# EasyEDA Pro project ProPrj_X-Link OB-RA4M2_M_2024-12-25.epro

# Schematic X-Link OB-RA4M2_M
Board Name: Board1; Create Date: 2024-11-27; Page Name: P1; Project Name: X-Link OB-RA4M2_M; Schematic Name: X-Link OB-RA4M2_M; Update Date: 2024-12-16; Company: 嘉立创EDA; Page Size: A4; Version: V1.0
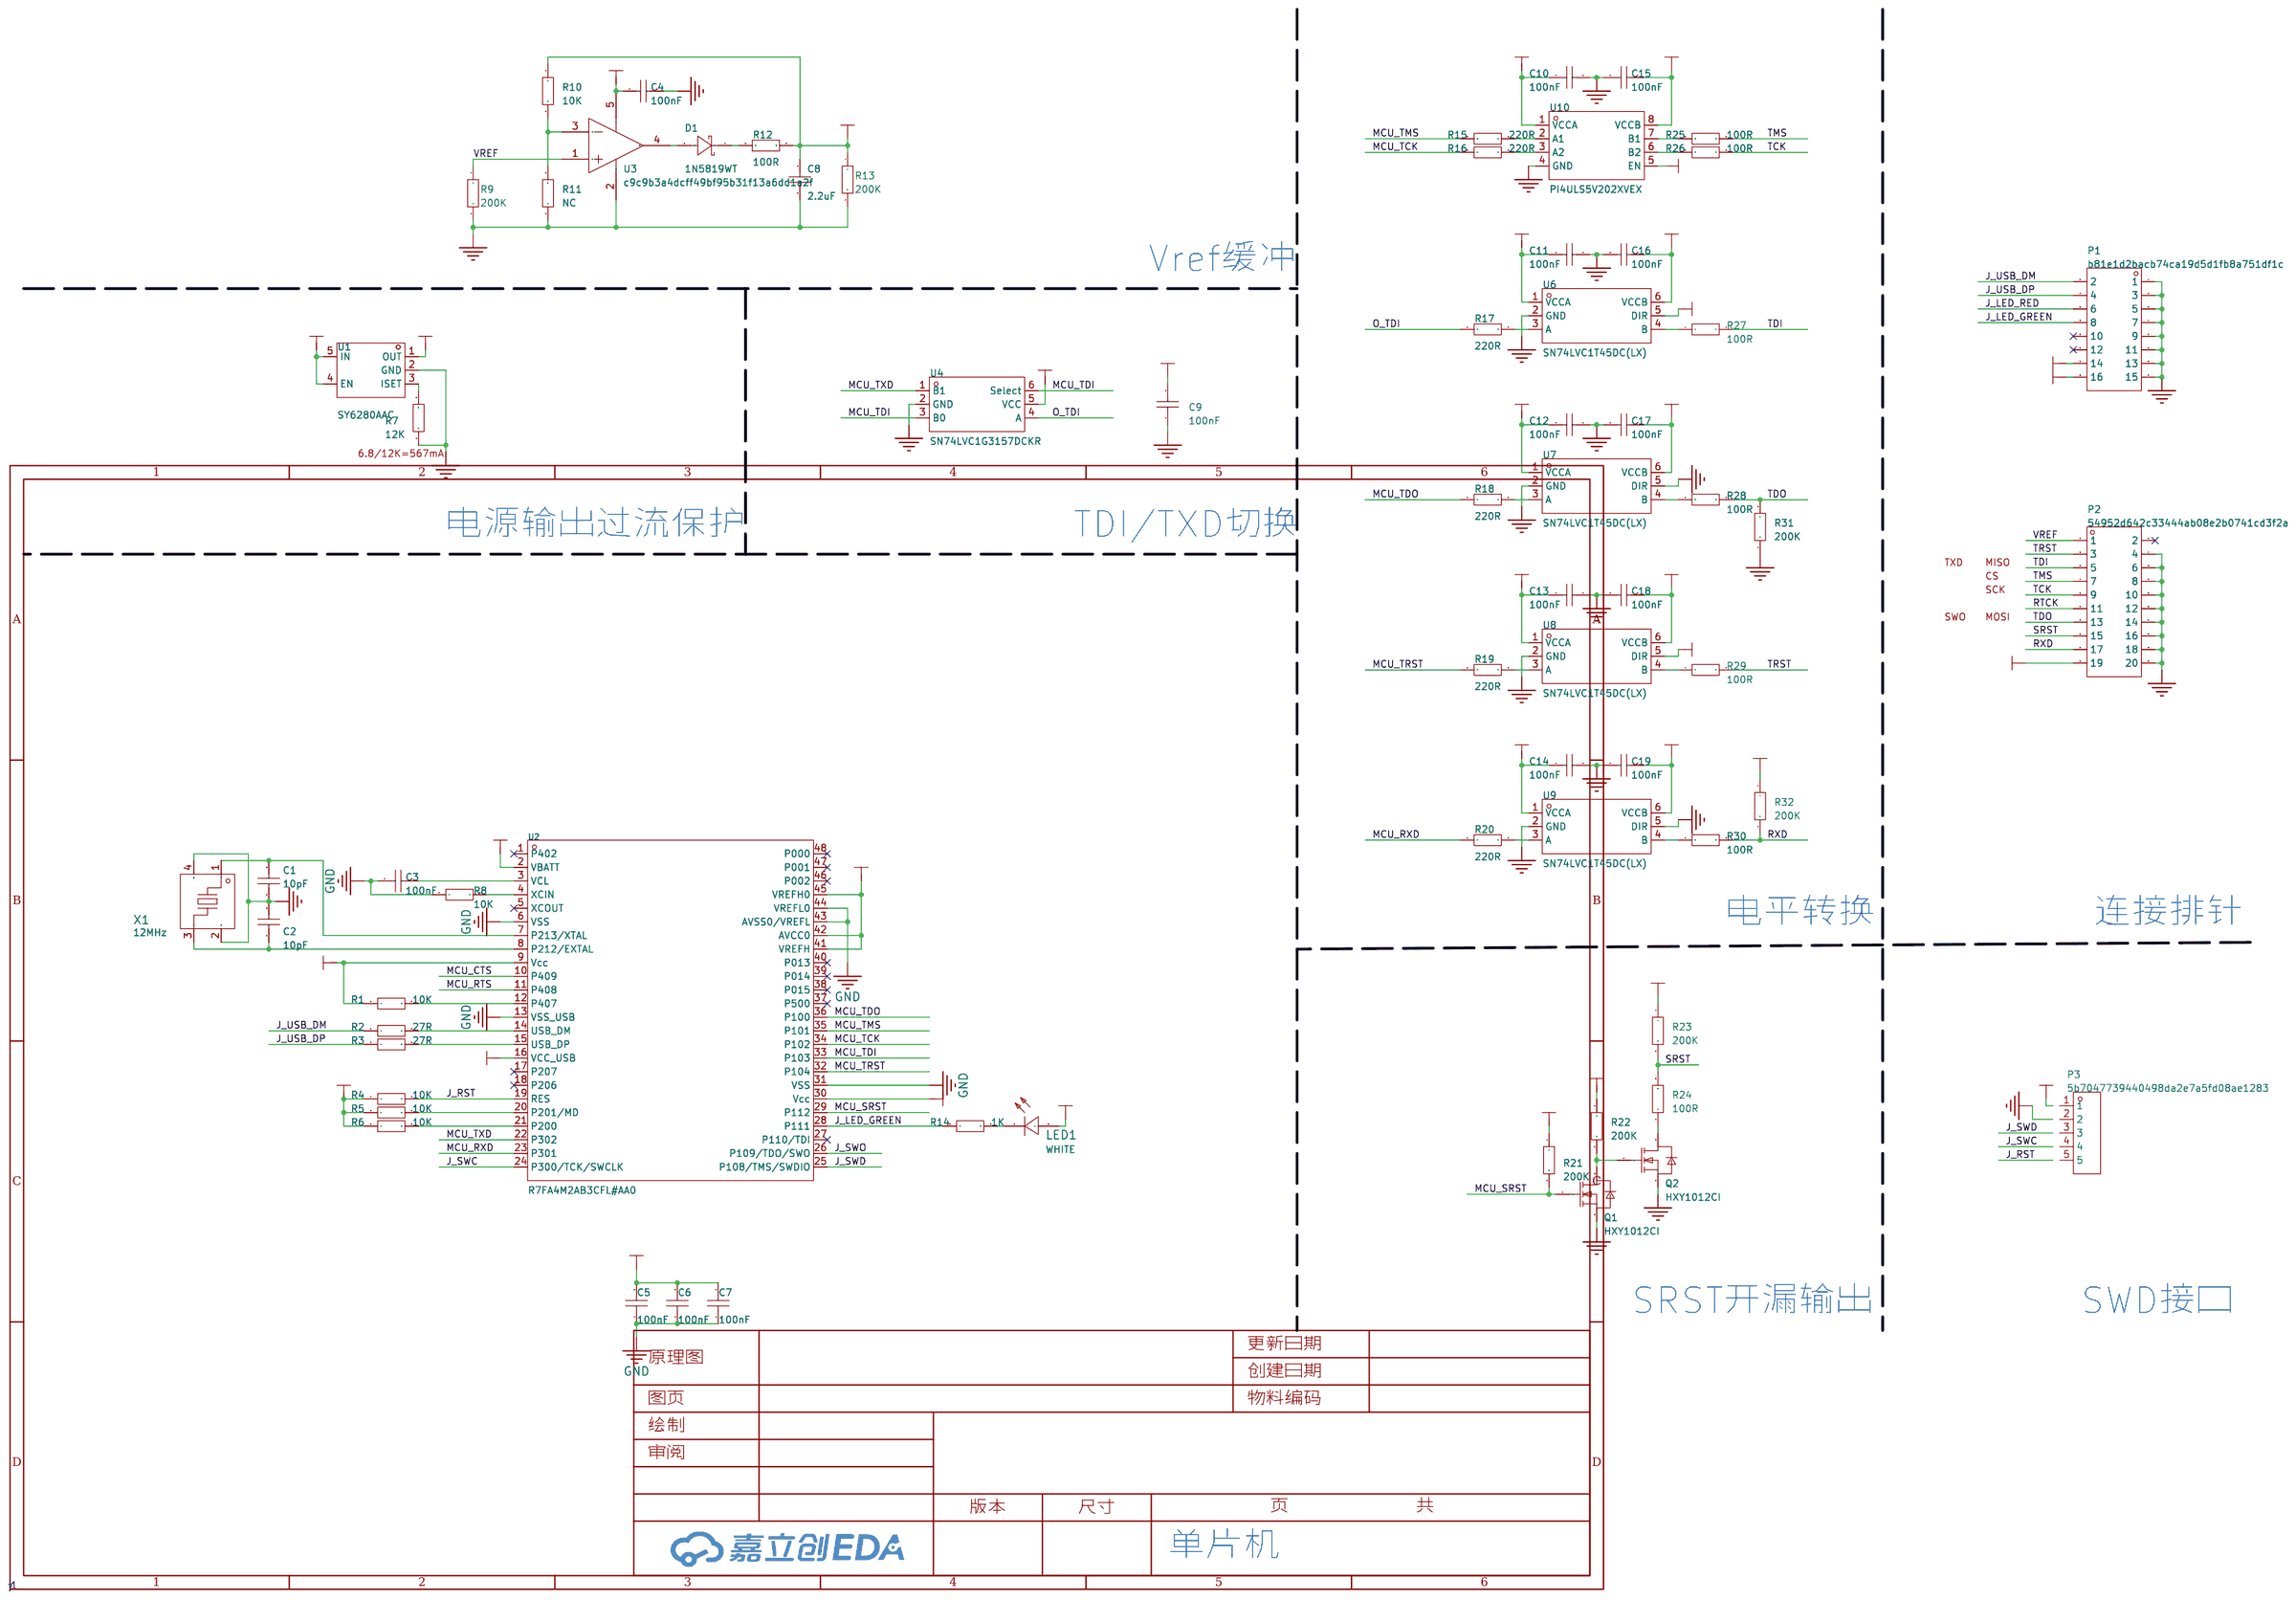
[diagram p0: schematic sheet]

## Parts
C1  10pF  [C0402]
C2  10pF  [C0402]
C3  100nF  [C0402]
C4  100nF  [C0402]
C5  100nF  [C0402]
C6  100nF  [C0402]
C7  100nF  [C0402]
C8  2.2uF  [C0402]
C9  100nF  [C0402]
C10  100nF  [C0402]
C11  100nF  [C0402]
C12  100nF  [C0402]
C13  100nF  [C0402]
C14  100nF  [C0402]
C15  100nF  [C0402]
C16  100nF  [C0402]
C17  100nF  [C0402]
C18  100nF  [C0402]
C19  100nF  [C0402]
D1  1N5819WT  [SOD-523_L1.2-W0.8-LS1.6-RD]
LED1  WHITE  [LED0603]
P1  b81e1d2bacb74ca19d5d1fb8a751df1c  [HDR-TH_16P-P1.27-V-M-R2-C8-S1.27-1]
P2  54952d642c33444ab08e2b0741cd3f2a  [HDR-TH_20P-P1.27-V-M-R2-C10-S1.27]
P3  5b7047739440498da2e7a5fd08ae1283  [HDR-TH_5P-P1.27-V-M]
Q1  HXY1012CI  [SOT-523-3_L1.6-W0.8-P0.50-LS1.6-BR]
Q2  HXY1012CI  [SOT-523-3_L1.6-W0.8-P0.50-LS1.6-BR]
R1  10K  [R0402]
R2  27R  [R0402]
R3  27R  [R0402]
R4  10K  [R0402]
R5  10K  [R0402]
R6  10K  [R0402]
R7  12K  [R0402]
R8  10K  [R0402]
R9  200K  [R0402]
R10  10K  [R0402]
R11  NC  [R0402]
R12  100R  [R0805]
R13  200K  [R0402]
R14  1K  [R0402]
R15  220R  [R0402]
R16  220R  [R0402]
R17  220R  [R0402]
R18  220R  [R0402]
R19  220R  [R0402]
R20  220R  [R0402]
R21  200K  [R0402]
R22  200K  [R0402]
R23  200K  [R0402]
R24  100R  [R0402]
R25  100R  [R0402]
R26  100R  [R0402]
R27  100R  [R0402]
R28  100R  [R0402]
R29  100R  [R0402]
R30  100R  [R0402]
R31  200K  [R0402]
R32  200K  [R0402]
U1  SY6280AAC  [SOT-23-5_L3.0-W1.7-P0.95-LS2.8-BL]
U2  R7FA4M2AB3CFL#AA0  [LQFP-48_L7.0-W7.0-P0.50-LS9.0-BL]
U3  c9c9b3a4dcff49bf95b31f13a6dd1a2f  [SOT-23-5_L2.9-W1.6-P0.95-LS2.8-BR]
U4  SN74LVC1G3157DCKR  [SC70-6_L2.1-W1.3-P0.65-LS2.3-BL]
U6  SN74LVC1T45DC(LX)  [SC-70-6_L2.2-W1.3-P0.65-LS2.1-BR]
U7  SN74LVC1T45DC(LX)  [SC-70-6_L2.2-W1.3-P0.65-LS2.1-BR]
U8  SN74LVC1T45DC(LX)  [SC-70-6_L2.2-W1.3-P0.65-LS2.1-BR]
U9  SN74LVC1T45DC(LX)  [SC-70-6_L2.2-W1.3-P0.65-LS2.1-BR]
U10  PI4ULS5V202XVEX  [UDFN-8_L1.6-W1.2-P0.40-BL]
X1  12MHz  [CRYSTAL-SMD_4P-L2.5-W2.0-BL-A]

## Library data of the parts
C1-C19 = C0402
D1 = 1N5819WT_C5185918: 二极管配置:独立式;正向压降(Vf):600mV@200mA;直流反向耐压(Vr):40V;整流电流:350mA;; LCSC Part Name: 电压:40V 电流:350mA; Supplier Part: C5185918; Manufacturer: Slkor(萨科微); Supplier Footprint: SOD-523; JLCPCB Part Class: 扩展库; Datasheet: https://atta.szlcsc.com/upload/public/pdf/source/20221009/97BA7A7C41FA3EE01B3D72EDF2EE8067.pdf; Supplier: LCSC; Diode Configuration: 独立式; Forward Voltage (Vf@If): 600mV@200mA; Reverse Voltage (Vr): 40V; Rectified Current: 350mA; Reverse Leakage Current (Ir): 5uA@30V
LED1 = LED0603
P1 = HDR2x8_1.27: 插针结构:2x8P;间距:1.27mm;行距:1.27mm;圆针/方针:方针;安装类型:直插;排数:双排;总PIN位数:16P;额定电流:1A;额定电压:500V;配合针长度:3.8mm;塑高:1mm;端接针长度:2.4mm;触头材质:黄铜;触头镀层:-;工作温度范围:-40℃~+105℃;焊接温度(最大值):260℃@10S;颜色:黑色;; LCSC Part Name: 2x8P 间距:1.27mm 方针 直插; Supplier Footprint: 插件,P=1.27mm; JLCPCB Part Class: 扩展库; Datasheet: https://atta.szlcsc.com/upload/public/pdf/source/20230314/463801427F572AD42B1A6214765822D0.pdf; Pin Structure: 2x8P; Pitch: 1.27mm; Row Spacing: 1.27mm; Circluar Pins/Square Pins: 方针; Mounting Type: 直插; Number of Rows: 双排; Number of Pins: 16P; Current Rating (Max): 1A; Voltage Rating (Max): 500V; Length of Mating Pin: 3.8mm; Insulation Height: 1mm; Length of End Connection Pin: 2.4mm; Contact Material: 黄铜; Operating Temperature Range: -40℃~+105℃; Soldering Temperature(Max): 260℃@10S; Color: 黑色
P2 = HDR2x10_1.27: 插针结构:2x10P;间距:1.27mm;行距:1.27mm;圆针/方针:方针;安装类型:直插;排数:双排;总PIN位数:20P;额定电流:1A;额定电压:500V;配合针长度:3.8mm;塑高:1mm;端接针长度:2.4mm;触头材质:黄铜;触头镀层:-;工作温度范围:-40℃~+105℃;焊接温度(最大值):260℃@10S;颜色:黑色;; LCSC Part Name: 2x10P 间距:1.27mm 方针 直插; Supplier Footprint: 插件,P=1.27mm; JLCPCB Part Class: 扩展库; Datasheet: https://atta.szlcsc.com/upload/public/pdf/source/20240702/A94E5E2C58EC168531668174128D95E4.pdf; Pin Structure: 2x10P; Pitch: 1.27mm; Row Spacing: 1.27mm; Circluar Pins/Square Pins: 方针; Mounting Type: 直插; Number of Rows: 双排; Number of Pins: 20P; Current Rating (Max): 1A; Voltage Rating (Max): 500V; Length of Mating Pin: 3.8mm; Insulation Height: 1mm; Length of End Connection Pin: 2.4mm; Contact Material: 黄铜; Operating Temperature Range: -40℃~+105℃; Soldering Temperature(Max): 260℃@10S; Color: 黑色
P3 = HDR1x5_1.27: 插针结构:1x5P;间距:1.27mm;行距:-;圆针/方针:方针;安装类型:直插;排数:单排;总PIN位数:5P;额定电流:1A;额定电压:250V;配合针长度:3.8mm;塑高:1mm;端接针长度:2.4mm;触头材质:黄铜;触头镀层:-;工作温度范围:-40℃~+105℃;焊接温度(最大值):260℃@10S;颜色:黑色;; LCSC Part Name: 1x5P 间距:1.27mm 方针 直插; Supplier Footprint: 插件,P=1.27mm; JLCPCB Part Class: 扩展库; Datasheet: https://atta.szlcsc.com/upload/public/pdf/source/20230316/674E7855FAF1BFD827413D68A2D1697C.pdf; Pin Structure: 1x5P; Pitch: 1.27mm; Circluar Pins/Square Pins: 方针; Mounting Type: 直插; Number of Rows: 单排; Number of Pins: 5P; Current Rating (Max): 1A; Voltage Rating (Max): 250V; Length of Mating Pin: 3.8mm; Insulation Height: 1mm; Length of End Connection Pin: 2.4mm; Contact Material: 黄铜; Operating Temperature Range: -40℃~+105℃; Soldering Temperature(Max): 260℃@10S; Color: 黑色
Q1 Q2 = HXY1012CI: 类型:1个N沟道;漏源电压(Vdss):20V;连续漏极电流(Id):800mA;导通电阻(RDS(on)@Vgs,Id):150mΩ@2.5V,0.5A;功率(Pd):150mW;阈值电压(Vgs(th)@Id):500mV@250uA;; LCSC Part Name: 1个N沟道 耐压:20V 电流:800mA; Supplier Part: C5148644; Manufacturer: HXY MOSFET(华轩阳电子); Supplier Footprint: SOT-523; JLCPCB Part Class: 扩展库; Datasheet: https://atta.szlcsc.com/upload/public/pdf/source/20221216/7678D929A4495F210F49E57C2201325F.pdf; Supplier: LCSC; Type: 1个N沟道; Drain Source Voltage (Vdss): 20V; Continuous Drain Current (Id): 800mA; Drain Source On Resistance (RDS(on)@Vgs,Id): 150mΩ@2.5V,0.5A; Power Dissipation (Pd): 150mW; Gate Threshold Voltage (Vgs(th)@Id): 500mV@250uA; Input Capacitance (Ciss@Vds): 50pF@16V; Reverse Transfer Capacitance (Crss@Vds): 4.5pF; Operating Temperature: -55℃~+150℃
R1-R11 R13-R32 = R0402
R12 = R0805: Tolerance: ±1%; Power(Watts): 125mW; Overload Voltage (Max): 150V
U1 = SY6280AAC_C55136: 低能耗配电开关; Supplier Part: C55136; Manufacturer: silergy(矽力杰); Supplier Footprint: SOT-23-5; JLCPCB Part Class: 扩展库; Datasheet: https://atta.szlcsc.com/upload/public/pdf/source/20161108/1478586372822.pdf; Supplier: LCSC
U2 = R7FA4M2AB3CFL#AA0: CPU内核:ARM-M系列;CPU最大主频:100MHz;工作电压范围:2.7V~3.6V;程序存储容量:254KB;GPIO端口数量:30;; Supplier Part: C3230219; Manufacturer: RENESAS(瑞萨)/IDT; Supplier Footprint: LFQFP-48(7x7); JLCPCB Part Class: 扩展库; Supplier: LCSC; CPU Core: ARM-M系列; CPU Maximum Speed: 100MHz; Operating Voltage Range: 2.7V~3.6V; Program Storage Size: 254KB; GPIO Ports Number: 30; ADC (Bit): 12bit; DAC (Bit): 12bit; Universal Serial Bus: 有; Watchdog: 有; Low-Voltage Detect: 有; Direct Memory Access: 有; Internal Oscillator: 有; Operating Temperature Range: -40℃~+105℃
U3 = LMV321: 轨到轨输入输出单运放; Supplier Footprint: SOT-23-5
U4 = SN74LVC1G3157DCKR: 开关电路:单刀双掷(SPDT)-常开/常闭;通道数:1;导通电阻(Ron@VCC):7Ω;; LCSC Part Name: 二选一模拟开关电路; Supplier Part: C2681224; Manufacturer: UMW(友台半导体); Supplier Footprint: SC-70-6; JLCPCB Part Class: 扩展库; Datasheet: https://atta.szlcsc.com/upload/public/pdf/source/20220825/F082194FBEE56472B5A702A7CC0A8AD7.pdf; Supplier: LCSC; Switch Circuit: 单刀双掷(SPDT)-常开/常闭; Number of Channels: 1; Supply Voltage: 1.65V~5.5V; Turn-on time: 5.2ns; On-State Resistance (Max): 7Ω; Turn-off time: 3.5ns
U6-U9 = SN74LVC1T45DC(LX): 数据速率:420Mbps;电压(VCCA):1.2V~5.5V;电压(VCCB):1.2V~5.5V;电路数:1;; Supplier Part: C22469932; Manufacturer: LX(灵星芯微); Supplier Footprint: SOT-363; JLCPCB Part Class: Extended Part; Datasheet: https://atta.szlcsc.com/upload/public/pdf/source/20240621/300AC48FAFCC5DC630ACF81FE330A7E9.pdf; Supplier: LCSC; Channel Type: 双向; Data Rate: 420Mbps; Supply Voltage (VCCA): 1.2V~5.5V; Supply Voltage (VCCB): 1.2V~5.5V; Number of Circuits: 1
U10 = PI4ULS5V202XVEX: 数据速率:20Mbps;电压(VCCA):1.2V~5.5V;电压(VCCB):1.2V~5.5V;电路数:1;每个电路通道数:2;; LCSC Part Name: 20Mbps 2位双向电平转换器; Supplier Part: C2677370; Manufacturer: DIODES(美台); Supplier Footprint: UDFN-8(1.2x1.6); JLCPCB Part Class: 扩展库; Datasheet: https://atta.szlcsc.com/upload/public/pdf/source/20221028/3F11BF7EE1CEB37ECF71FE83083EAFB9.pdf; Supplier: LCSC; Channel Type: 双向; Data Rate: 20Mbps; Supply Voltage (VCCA): 1.2V~5.5V; Supply Voltage (VCCB): 1.2V~5.5V; Number of Circuits: 1; Channels per Circuit: 2; Output Type: 三态；非反相; Operating Temperature: -40℃~+85℃; Features: 自动方向检测
X1 = XTAL2520

## Nets
3.3V: C5.2 C6.2 C7.2 C9.2 C10.1 C11.1 C12.1 C13.1 C14.1 LED1.2(+) P1.14 R1.1 R4.1 R5.1 R6.1 R21.1 R22.1 U2.2(VBATT) U2.9(Vcc) U2.16(VCC_USB) U2.30(Vcc) U2.41(VREFH) U2.42(AVCC0) U2.45(VREFH0) U4.5(VCC) U6.1(VCCA) U6.5(DIR) U7.1(VCCA) U8.1(VCCA) U8.5(DIR) U9.1(VCCA) U10.1(VCCA) U10.5(EN)
5V: C4.1 P1.16 U1.4(EN) U1.5(IN) U3.5(VCC+)
5V_OUT: P2.19 U1.1(OUT)
GND: C1.1 C2.2 C3.1 C4.2 C5.1 C6.1 C7.1 C8.1 C9.1 C10.2 C11.2 C12.2 C13.2 C14.2 C15.1 C16.1 C17.1 C18.1 C19.1 P1.1 P1.3 P1.5 P1.7 P1.9 P1.11 P1.13 P1.15 P2.4 P2.6 P2.8 P2.10 P2.12 P2.14 P2.16 P2.18 P2.20 Q1.2(S) Q2.2(S) R7.1 R8.1 R9.2 R11.1 R13.2 R31.1 U1.2(GND) U2.6(VSS) U2.13(VSS_USB) U2.31(VSS) U2.43(AVSS0/VREFL) U2.44(VREFL0) U3.2(GND) U4.2(GND) U6.2(GND) U7.2(GND) U7.5(DIR) U8.2(GND) U9.2(GND) U9.5(DIR) U10.4(GND) X1.2(GND) X1.4(GND)
J_LED_GREEN: P1.8 R14.1 U2.28(P111)
J_LED_RED: P1.6
J_RST: R4.2 U2.19(RES)
J_SWC: U2.24(P300/TCK/SWCLK)
J_SWD: U2.25(P108/TMS/SWDIO)
J_SWO: U2.26(P109/TDO/SWO)
J_USB_DM: P1.2 R2.1
J_USB_DP: P1.4 R3.1
MCU_CTS: U2.10(P409)
MCU_RTS: U2.11(P408)
MCU_RXD: R20.1 U2.23(P301)
MCU_SRST: Q1.1(G) R21.2 U2.29(P112)
MCU_TCK: R16.1 U2.34(P102)
MCU_TDI: U2.33(P103) U4.3(B0) U4.6(Select)
MCU_TDO: R18.1 U2.36(P100)
MCU_TMS: R15.1 U2.35(P101)
MCU_TRST: R19.1 U2.32(P104)
MCU_TXD: U2.22(P302) U4.1(B1)
O_TDI: R17.1 U4.4(A)
RTCK: P2.11
RXD: P2.17 R30.2 R32.2
SRST: P2.15 R23.2 R24.2
TCK: P2.9 R26.2
TDI: P2.5 R27.2
TDO: P2.13 R28.2 R31.2
TMS: P2.7 R25.2
TRST: P2.3 R29.2
VIO: C8.2 C15.2 C16.2 C17.2 C18.2 C19.2 R10.1 R12.1 R13.1 R23.1 R32.1 U6.6(VCCB) U7.6(VCCB) U8.6(VCCB) U9.6(VCCB) U10.8(VCCB)
VREF: P2.1 R9.1 U3.1(+IN)
$1N3245: C3.2 U2.3(VCL)
$1N3248: R8.2 U2.4(XCIN)
$1N3444: R1.2 U2.12(P407)
$1N3469: R2.2 U2.14(USB_DM)
$1N3474: R3.2 U2.15(USB_DP)
$1N3583: R5.2 U2.20(P201/MD)
$1N3586: R6.2 U2.21(P200)
$1N4934: LED1.1(-) R14.2
$1N14125: C1.2 U2.7(P213/XTAL) X1.1
$1N14126: C2.1 U2.8(P212/EXTAL) X1.3
$1N15634: R25.1 U10.7(B1)
$1N15637: R26.1 U10.6(B2)
$1N15645: R15.2 U10.2(A1)
$1N15648: R16.2 U10.3(A2)
$1N15959: Q2.3(D) R24.1
$1N16531: R10.2 R11.2 U3.3(-IN)
$1N16533: D1.1 R12.2
$1N16535: D1.2 U3.4(OUT)
$1N17836: R27.1 U6.4(B)
$1N17840: R17.2 U6.3(A)
$1N18390: R28.1 U7.4(B)
$1N18396: R18.2 U7.3(A)
$1N18633: R29.1 U8.4(B)
$1N18638: R19.2 U8.3(A)
$1N18909: R30.1 U9.4(B)
$1N18911: R20.2 U9.3(A)
$1N20562: R7.2 U1.3(ISET)
$1N22925: Q1.3(D) Q2.1(G) R22.2

Not connected (* = marked no-connect by the designer): P1 10* 12*; P2 2*; P3 1 2 3 4 5; U2 1(P402)* 5(XCOUT)* 17(P207)* 18(P206)* 27(P110/TDI)* 37(P500)* 38(P015)* 39(P014)* 40(P013)* 46(P002)* 47(P001)* 48(P000)*

## Notes on the sheet
- Vref缓冲
- 6.8/12K=567mA
- 电源输出过流保护
- TDI/TXD切换
- TXD
- MISO
- CS
- SCK
- SWO
- MOSI
- 电平转换
- 连接排针
- SRST开漏输出
- SWD接口
- 单片机

# Board X-Link OB-RA4M2_M
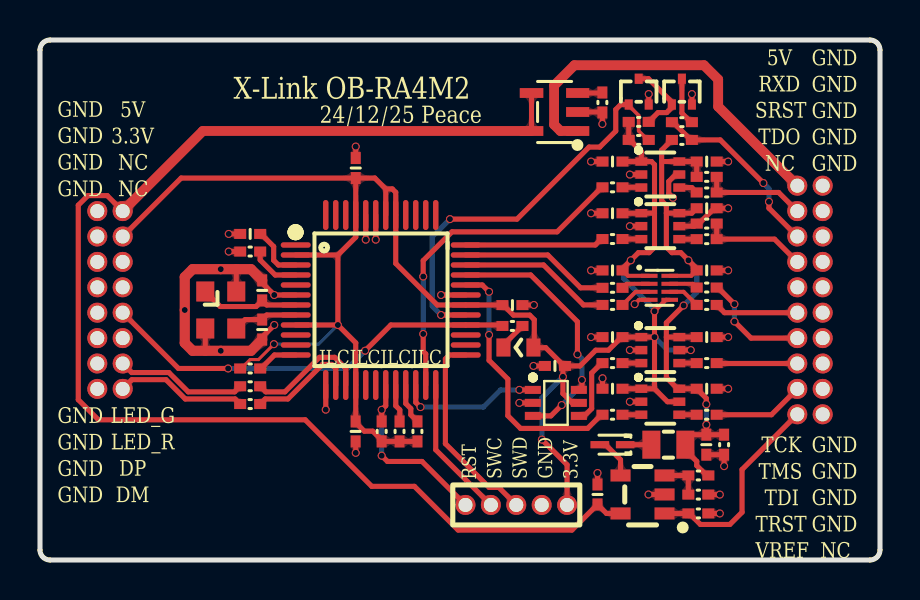
[diagram p1: board, top side]
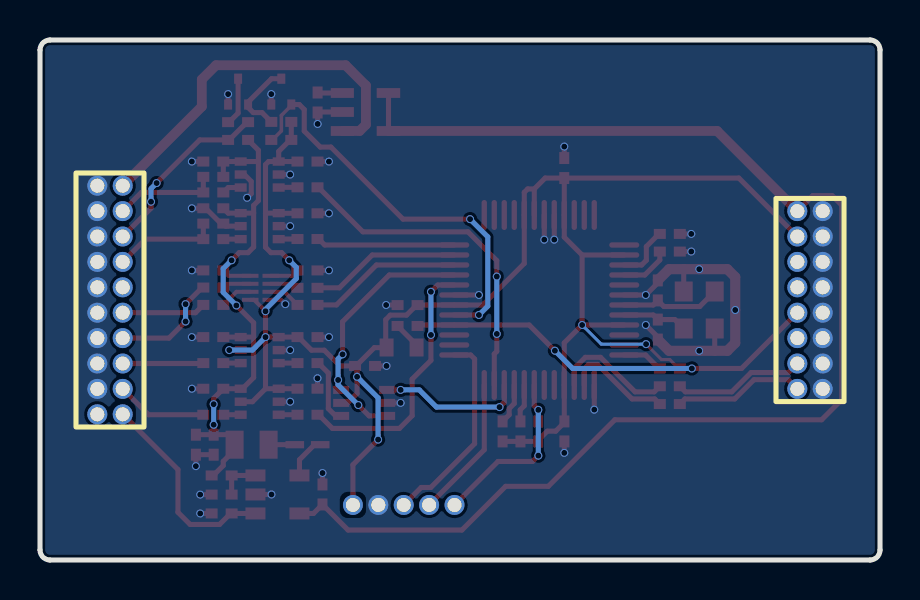
[diagram p2: board, bottom side, seen from below]

Outline 42 x 26 mm; copper layers: Top Layer, Bottom Layer. Coordinates in mm from the lower left corner of the outline.
Outline path: 0,25.5 0,0.5 arc(0.15,0.15) 0.5,0 41.5,0 arc(41.85,0.15) 42,0.5 42,25.5 arc(41.85,25.85) 41.5,26 0.5,26 arc(0.15,25.85) 0,25.5
Stack: Top Layer 0.035mm / Dielectric1 1.51mm FR4 er 4.5 / Bottom Layer 0.035mm

## Design rules (mm)
template: 双面板
spacing copperThickness1oz (default): track to track 0.102, other pairs 0.102 to 0.201
spacing copperThickness2oz: track to track 0.203, other pairs 0.152 to 0.3
track width copperThickness1oz (default): min 0.102, default 0.254, max 2.54
track width copperThickness2oz: min 0.203, default 0.254, max 2.54
differential pair differentialPair (default): width min 0.127, default 0.254, max 2.54; gap min 0.152, default 0.152
via viaSize (default): diameter min 0.399, default 0.399, max 10; hole min 0.3, default 0.3, max 6.299

## Placement (name value [footprint] x y rotation side)
C1  10pF  [C0402]  11.11 13.48 270 top
C2  10pF  [C0402]  11.11 11.52 270 top
C3  100nF  [C0402]  10.51 16.3 0 top
C4  100nF  [C0402]  27.88 3.28 90 top
C5  100nF  [C0402]  15.78 6.43 90 top
C6  100nF  [C0402]  23.62 12.74 180 top
C7  100nF  [C0402]  15.79 19.6 270 top
C8  2.2uF  [C0402]  33.32 5.77 90 top
C9  100nF  [C0402]  25.75 9.7 0 top
C10  100nF  [C0402]  28.63 14.48 180 top
C11  100nF  [C0402]  28.63 11.15 180 top
C12  100nF  [C0402]  28.63 17.34 180 top
C13  100nF  [C0402]  28.63 8.56 180 top
C14  100nF  [C0402]  28.63 19.92 180 top
C15  100nF  [C0402]  33.34 14.48 180 top
C16  100nF  [C0402]  33.34 11.15 180 top
C17  100nF  [C0402]  33.34 17.59 180 top
C18  100nF  [C0402]  33.34 8.56 180 top
C19  100nF  [C0402]  33.34 19.92 180 top
D1  1N5819WT  [SOD-523_L1.2-W0.8-LS1.6-RD]  28.63 5.77 180 top
LED1  WHITE  [LED0603]  23.92 10.62 0 top
P1  b81e1d2bacb74ca19d5d1fb8a751df1c  [HDR-TH_16P-P1.27-V-M-R2-C8-S1.27-1]  3.5 13 90 bottom
P2  54952d642c33444ab08e2b0741cd3f2a  [HDR-TH_20P-P1.27-V-M-R2-C10-S1.27]  38.5 13 90 bottom
P3  5b7047739440498da2e7a5fd08ae1283  [HDR-TH_5P-P1.27-V-M]  23.81 2.75 180 top
Q1  HXY1012CI  [SOT-523-3_L1.6-W0.8-P0.50-LS1.6-BR]  29.94 23.42 270 top
Q2  HXY1012CI  [SOT-523-3_L1.6-W0.8-P0.50-LS1.6-BR]  32.1 23.42 270 top
R1  10K  [R0402]  10.51 9.58 0 top
R2  27R  [R0402]  10.51 7.8 0 top
R3  27R  [R0402]  10.51 8.69 0 top
R4  10K  [R0402]  17.08 6.43 90 top
R5  10K  [R0402]  17.98 6.43 90 top
R6  10K  [R0402]  18.87 6.43 90 top
R7  12K  [R0402]  28.12 22.88 90 top
R8  10K  [R0402]  10.51 15.42 0 top
R9  200K  [R0402]  32.92 2.33 0 top
R10  10K  [R0402]  32.92 4.23 180 top
R11  NC  [R0402]  32.92 3.27 180 top
R12  100R  [R0805]  31.42 5.77 180 top
R13  200K  [R0402]  34.21 5.77 270 top
R14  1K  [R0402]  23.62 11.7 0 top
R15  220R  [R0402]  28.63 13.61 0 top
R16  220R  [R0402]  28.63 12.75 0 top
R17  220R  [R0402]  28.63 9.85 0 top
R18  220R  [R0402]  28.63 16.05 0 top
R19  220R  [R0402]  28.63 7.26 0 top
R20  220R  [R0402]  28.63 18.63 0 top
R21  200K  [R0402]  29.94 21 0 top
R22  200K  [R0402]  29.94 21.91 0 top
R23  200K  [R0402]  32.1 21 0 top
R24  100R  [R0402]  32.1 21.89 180 top
R25  100R  [R0402]  33.34 13.62 0 top
R26  100R  [R0402]  33.34 12.75 0 top
R27  100R  [R0402]  33.34 9.85 0 top
R28  100R  [R0402]  33.34 16.04 0 top
R29  100R  [R0402]  33.34 7.26 0 top
R30  100R  [R0402]  33.34 18.38 0 top
R31  200K  [R0402]  33.34 16.82 0 top
R32  200K  [R0402]  33.34 19.16 0 top
U1  SY6280AAC  [SOT-23-5_L3.0-W1.7-P0.95-LS2.8-BL]  25.73 22.4 90 top
U2  R7FA4M2AB3CFL#AA0  [LQFP-48_L7.0-W7.0-P0.50-LS9.0-BL]  17.04 13 270 top
U3  c9c9b3a4dcff49bf95b31f13a6dd1a2f  [SOT-23-5_L2.9-W1.6-P0.95-LS2.8-BR]  30.13 3.28 0 top
U4  SN74LVC1G3157DCKR  [SC70-6_L2.1-W1.3-P0.65-LS2.3-BL]  25.79 7.86 270 top
U6  SN74LVC1T45DC(LX)  [SC-70-6_L2.2-W1.3-P0.65-LS2.1-BR]  31.02 10.5 180 top
U7  SN74LVC1T45DC(LX)  [SC-70-6_L2.2-W1.3-P0.65-LS2.1-BR]  31.02 16.69 180 top
U8  SN74LVC1T45DC(LX)  [SC-70-6_L2.2-W1.3-P0.65-LS2.1-BR]  31.02 7.91 180 top
U9  SN74LVC1T45DC(LX)  [SC-70-6_L2.2-W1.3-P0.65-LS2.1-BR]  31.02 19.27 180 top
U10  PI4ULS5V202XVEX  [UDFN-8_L1.6-W1.2-P0.40-BL]  30.98 13.61 270 top
X1  12MHz  [CRYSTAL-SMD_4P-L2.5-W2.0-BL-A]  9.04 12.5 270 top

## Footprints (pads in the part's own frame, mm; a bottom-side part is the same pattern mirrored in y, then rotated)
C0402
  rect 0.6x0.5 smd: 1(-0.5,0) 2(0.5,0)
CRYSTAL-SMD_4P-L2.5-W2.0-BL-A
  rect 1x0.9 smd: 1(-0.925,-0.775) 2(0.925,-0.775) 3(0.925,0.775) 4(-0.925,0.775)
HDR-TH_5P-P1.27-V-M
  rrect 1x1 hole 0.7: 1(-2.54,0)
  round 1 hole 0.7: 2(-1.27,0) 3(0,0) 4(1.27,0) 5(2.54,0)
HDR-TH_16P-P1.27-V-M-R2-C8-S1.27-1
  rrect 1x1 hole 0.7: 1(-4.445,-0.635)
  round 1 hole 0.7: 2(-4.445,0.635) 3(-3.175,-0.635) 4(-3.175,0.635) 5(-1.905,-0.635) 6(-1.905,0.635) 7(-0.635,-0.635) 8(-0.635,0.635) 9(0.635,-0.635) 10(0.635,0.635) 11(1.905,-0.635) 12(1.905,0.635) 13(3.175,-0.635) 14(3.175,0.635) 15(4.445,-0.635) 16(4.445,0.635)
HDR-TH_20P-P1.27-V-M-R2-C10-S1.27
  rrect 1x1 hole 0.7: 1(-5.715,-0.635)
  round 1 hole 0.7: 2(-5.715,0.635) 3(-4.445,-0.635) 4(-4.445,0.635) 5(-3.175,-0.635) 6(-3.175,0.635) 7(-1.905,-0.635) 8(-1.905,0.635) 9(-0.635,-0.635) 10(-0.635,0.635) 11(0.635,-0.635) 12(0.635,0.635) 13(1.905,-0.635) 14(1.905,0.635) 15(3.175,-0.635) 16(3.175,0.635) 17(4.445,-0.635) 18(4.445,0.635) 19(5.715,-0.635) 20(5.715,0.635)
LED0603
  rect 0.7x0.9 smd: 1(-0.75,0.008) 2(0.75,0.008)
LQFP-48_L7.0-W7.0-P0.50-LS9.0-BL
  oval 0.27x1.5 smd: 1(-2.75,-4.25) 2(-2.25,-4.25) 3(-1.75,-4.25) 4(-1.25,-4.25) 5(-0.75,-4.25) 6(-0.25,-4.25) 7(0.25,-4.25) 8(0.75,-4.25) 9(1.25,-4.25) 10(1.75,-4.25) 11(2.25,-4.25) 12(2.75,-4.25) 25(2.75,4.25) 26(2.25,4.25) 27(1.75,4.25) 28(1.25,4.25) 29(0.75,4.25) 30(0.25,4.25) 31(-0.25,4.25) 32(-0.75,4.25) 33(-1.25,4.25) 34(-1.75,4.25) 35(-2.25,4.25) 36(-2.75,4.25)
  oval 1.5x0.27 smd: 13(4.25,-2.75) 14(4.25,-2.25) 15(4.25,-1.75) 16(4.25,-1.25) 17(4.25,-0.75) 18(4.25,-0.25) 19(4.25,0.25) 20(4.25,0.75) 21(4.25,1.25) 22(4.25,1.75) 23(4.25,2.25) 24(4.25,2.75) 37(-4.25,2.75) 38(-4.25,2.25) 39(-4.25,1.75) 40(-4.25,1.25) 41(-4.25,0.75) 42(-4.25,0.25) 43(-4.25,-0.25) 44(-4.25,-0.75) 45(-4.25,-1.25) 46(-4.25,-1.75) 47(-4.25,-2.25) 48(-4.25,-2.75)
R0402
  rect 0.6x0.5 smd: 1(-0.5,0) 2(0.5,0)
R0805
  rect 0.9x1.4 smd: 1(-0.85,0) 2(0.85,0)
SC70-6_L2.1-W1.3-P0.65-LS2.3-BL
  rect 0.4x0.8 smd: 1(-0.65,-1.15) 2(-0.001,-1.15) 3(0.65,-1.15) 4(0.65,1.15) 5(0,1.15) 6(-0.65,1.15)
SC-70-6_L2.2-W1.3-P0.65-LS2.1-BR
  rect 0.6x0.42 smd: 1(0.95,-0.65) 2(0.95,0) 3(0.95,0.65) 4(-0.95,0.65) 5(-0.95,0) 6(-0.95,-0.65)
SOD-523_L1.2-W0.8-LS1.6-RD
  rect 0.93x0.36 smd: 1(-0.635,0) 2(0.635,0)
SOT-23-5_L2.9-W1.6-P0.95-LS2.8-BR
  rect 1x0.6 smd: 1(1.1,-0.95) 2(1.1,0) 3(1.1,0.95) 4(-1.1,0.95) 5(-1.1,-0.95)
SOT-23-5_L3.0-W1.7-P0.95-LS2.8-BL
  rect 0.49x1.157 smd: 1(-0.95,-1.153) 2(0,-1.153) 3(0.95,-1.153)
  rect 0.49x1.175 smd: 4(0.95,1.153) 5(-0.95,1.153)
SOT-523-3_L1.6-W0.8-P0.50-LS1.6-BR
  rect 0.51x0.4 smd: 1(0.645,-0.5) 2(0.645,0.5) 3(-0.645,0)
UDFN-8_L1.6-W1.2-P0.40-BL
  rect 0.2x0.825 smd: 1(-0.6,-0.512) 2(-0.2,-0.512) 3(0.2,-0.512) 4(0.6,-0.512) 5(0.6,0.512) 6(0.2,0.512) 7(-0.2,0.512) 8(-0.6,0.512)

## Nets
As in the schematic, except:
3.3V: C5.2 C6.2 C7.2 C9.2 C10.1 C11.1 C12.1 C13.1 C14.1 LED1.2 P1.14 P3.1 R1.1 R4.1 R5.1 R6.1 R21.1 R22.1 U2.2 U2.9 U2.16 U2.30 U2.41 U2.42 U2.45 U4.5 U6.1 U6.5 U7.1 U8.1 U8.5 U9.1 U10.1 U10.5
GND: C1.1 C2.2 C3.1 C4.2 C5.1 C6.1 C7.1 C8.1 C9.1 C10.2 C11.2 C12.2 C13.2 C14.2 C15.1 C16.1 C17.1 C18.1 C19.1 P1.1 P1.3 P1.5 P1.7 P1.9 P1.11 P1.13 P1.15 P2.4 P2.6 P2.8 P2.10 P2.12 P2.14 P2.16 P2.18 P2.20 P3.2 Q1.2 Q2.2 R7.1 R8.1 R9.2 R11.1 R13.2 R31.1 U1.2 U2.6 U2.13 U2.31 U2.43 U2.44 U3.2 U4.2 U6.2 U7.2 U7.5 U8.2 U9.2 U9.5 U10.4 X1.2 X1.4
J_RST: P3.5 R4.2 U2.19
J_SWC: P3.4 U2.24
J_SWD: P3.3 U2.25

Pads without a net: P1 10 12; P2 2; U2 1 5 17 18 27 37 38 39 40 46 47 48

## Via types
v1: diameter 0.4, hole 0.3, Top Layer to Bottom Layer, 71 vias

## Routing (per net, layer and track width the routed paths; a pad name or vN(x,y) marks a point on that pad's centre or on a via; arc(x,y) is an arc through that point)
3.3V: length 100
  Top Layer w0.152: R1.1 10.06,9.58 10.51,10.02 10.93,10.02 v1(11.7,10.79)
  Top Layer w0.201: U10.1 29.4,14.21 C10.1 ; v1(30.73,12.44) 31.3,13.01 U10.5
  Top Layer w0.254: v1(30.73,12.44) v1(30.73,11.15) ; v1(30.73,11.15) U6.1 C11.1 29.08,11.15 28.42,10.49 27.79,10.49 27,9.7 C9.2 ; v1(30.73,11.15) 30.73,8.56 ; U9.1 30.57,19.92 30.73,19.77 30.73,17.34 ; U9.1 30.07,20.43 29.49,21 R21.1 R22.1 ; U9.1 C14.1 ; v1(14.89,11.75) U2.9 ; v1(14.89,11.75) 14.89,15.25 ; v1(14.89,11.75) 15.79,10.86 U2.16 15.79,6.94 C5.2 15.78,6.88 16.22,6.44 16.64,6.44 17.08,5.99 R4.1 R5.1 R6.1 ; v1(32.54,10.5) U6.5 ; C7.2 U2.45 15.79,16.14 14.89,15.25 ; C7.2 7.06,19.1 P1.14 ; C7.2 16.74,19.1 17.29,18.55 ; U4.5 26.61,7.86 26.15,8.32 v1(26.15,9.16) 26.15,9.6 C9.2 ; U8.5 31.38,7.91 30.73,8.56 ; C9.2 26.2,9.7 25.28,10.62 24.67,10.62 24.71,10.66 24.71,12.01 24.49,12.24 23.67,12.24 23.17,12.74 C6.2 23.12,12.75 U2.30 19.86,12.75 17.79,14.83 U2.41 17.79,18.38 17.62,18.55 17.29,18.55 ; 17.29,18.55 U2.42 ; 30.73,17.34 U7.1 30.06,17.34 C12.1 ; 30.73,17.34 30.73,15.64 30.45,15.37 29.92,15.37 v1(29.54,14.99) 29.13,14.57 C10.1 ; 14.89,15.25 U2.2 ; P3.1 26.35,4.76 v1(25.1,6.02) ; 30.73,8.56 U8.1 C13.1
  Bottom Layer w0.152: v1(11.7,10.79) 13.94,10.79 v1(14.89,11.75)
  Bottom Layer w0.254: v1(30.73,12.44) 30.73,12.53 29.18,14.07 29.18,14.63 v1(29.54,14.99) ; v1(32.54,10.5) 31.38,10.5 v1(30.73,11.15) ; v1(25.1,6.02) 25.1,8.11 v1(26.15,9.16)
5V: length 67
  Top Layer w0.254: 24.58,23.35 24.58,21.45 ; P1.16 3.36,18.22 2.39,18.22 1.91,17.74 1.91,8.01 2.92,7.01 13.26,7.01 16.59,3.68 18.72,3.68 20.9,1.5 26.6,1.5 C4.1 28.33,2.33 U3.5
  Top Layer w0.49: P1.16 8.14,21.45 24.58,21.45
5V_OUT: length 19.1
  Top Layer w0.49: P2.19 33.91,22.67 33.91,24.03 33.2,24.74 26.72,24.74 25.7,23.72 25.7,21.77 26.02,21.45 U1.1
GND: length 45.6
  Top Layer w0.201: U10.4 29.95,13.01 v1(29.73,12.79)
  Top Layer w0.254: v1(23.97,7.86) U4.2 ; v1(34.41,14.48) C15.1 ; v1(28.13,9.09) C13.2 ; v1(27.55,14.48) C10.2 ; v1(28.12,21.8) R7.1 28.09,22.4 U1.2 ; v1(16.79,16.02) U2.43 ; v1(34.41,19.92) C19.1 ; v1(16.29,16.02) U2.44 ; v1(33.99,2.33) R9.2 ; v1(29.49,10.5) U6.2 ; v1(29.49,16.69) U7.2 ; v1(15.79,5.36) 15.79,5.93 ; v1(27.55,19.92) C14.2 ; v1(20.05,13.25) U2.31 ; v1(15.79,20.67) C7.1 ; v1(34.21,4.69) R13.2 C8.1 ; v1(34.41,17.59) C17.1 33.72,17.59 32.95,16.82 R31.1 32.71,16.69 U7.5 ; v1(9.44,15.42) R8.1 ; U2.6 v1(11.71,13.25) 11.08,13.88 11.08,13.95 C1.1 ; v1(24.69,12.75) 24.12,12.75 ; v1(24.68,9.7) C9.1 ; v1(32.6,23.3) Q2.2 ; X1.2 8.26,10.46 ; v1(11.71,11.75) 11.08,11.12 11.08,11.05 C2.2 ; v1(31.64,18.11) 31.44,18.32 31.44,18.93 31.78,19.27 U9.5 ; v1(9.44,16.3) C3.1 ; X1.4 9.81,14.54 ; v1(27.55,11.15) C11.2 ; v1(27.55,17.34) C12.2 ; v1(29.49,19.27) U9.2 ; v1(30.44,23.3) Q1.2 ; v1(27.88,4.35) C4.2 ; v1(29.49,7.91) U8.2 ; v1(34.41,8.56) C18.1 ; v1(34.41,11.15) C16.1 ; v1(30.43,3.28) U3.2 ; v1(14.29,7.52) U2.13 ; v1(33.99,3.27) R11.1
  Top Layer w0.508: C1.1 10.55,14.54 v1(9.04,14.54) 7.63,14.54 7.24,14.15 v1(7.24,12.5) 7.24,10.85 7.63,10.46 v1(9.04,10.46) 10.55,10.46 C2.2
J_LED_GREEN: length 21.1
  Top Layer w0.254: R14.1 23.07,11.75 U2.28 17.54,11.75 v1(16.26,10.47) ; P1.8 6.92,9.58 v1(9.41,9.58)
  Bottom Layer w0.254: v1(9.41,9.58) 15.37,9.58 v1(16.26,10.47)
J_RST: length 9.4
  Top Layer w0.254: P3.5 19.1,4.93 17.37,4.93 v1(17.08,5.22) ; U2.19 17.29,7.71 v1(17.08,7.51) R4.2
  Bottom Layer w0.254: v1(17.08,7.51) v1(17.08,5.22)
J_SWC: length 7.1
  Top Layer w0.254: U2.24 19.79,5.51 P3.4
J_SWD: length 10.2
  Top Layer w0.254: U2.25 20.47,10.25 20.27,10.05 20.27,5.82 22.46,3.63 22.94,3.63 P3.3
J_USB_DM: length 6.6
  Top Layer w0.254: P1.2 4.6,9.02 6.3,9.02 7.26,8.05 9.76,8.05 R2.1
J_USB_DP: length 6.6
  Top Layer w0.254: R3.1 9.73,8.41 7.41,8.41 6.45,9.37 4.59,9.37 P1.4
MCU_RXD: length 16.8
  Top Layer w0.254: U2.23 19.29,10.3 19.16,10.43 v1(19.16,11.3) ; v1(19.16,14.17) 19.16,14.97 20.6,16.41 25.86,16.41 28.08,18.63 R20.1
  Bottom Layer w0.254: v1(19.16,14.17) 19.16,11.33 19.19,11.3
MCU_SRST: length 20.7
  Top Layer w0.178: R21.2 30.38,21 29.93,21.46 29.93,22.23 29.44,22.72 Q1.1
  Top Layer w0.254: Q1.1 29.04,22.77 28.79,22.52 28.79,21.45 27.99,20.65 27.45,20.65 23.85,17.04 v1(20.5,17.04) ; v1(20.05,12.25) U2.29
  Bottom Layer w0.254: v1(20.05,12.25) 19.61,12.7 19.61,16.15 v1(20.5,17.04)
MCU_TCK: length 7.7
  Top Layer w0.254: R16.1 27.17,12.75 25.18,14.75 U2.34
MCU_TDI: length 13.5
  Top Layer w0.254: U2.33 24.54,14.25 26.87,11.91 v1(26.87,10.28) ; v1(26.09,7.75) 25.54,7.21 U4.3 ; U4.6 27.1,8.66 v1(27.1,9)
  Bottom Layer w0.254: v1(26.09,7.75) 27.1,8.76 v1(27.1,9) 27.1,10.06 v1(26.87,10.28)
MCU_TDO: length 7
  Top Layer w0.254: U2.36 27.76,15.75 28.06,16.05 R18.1
MCU_TMS: length 7.5
  Top Layer w0.254: U2.35 25.39,15.25 27.03,13.61 R15.1
MCU_TRST: length 13.2
  Top Layer w0.254: v1(22.45,13.41) 22.11,13.75 U2.32 ; R19.1 28.07,7.26 27.38,6.58 24.03,6.58 23.39,7.21 23.39,9.04 22.45,9.98 v1(22.45,11.25)
  Bottom Layer w0.254: v1(22.45,13.41) v1(22.45,11.25)
MCU_TXD: length 7.2
  Top Layer w0.254: v1(23.97,8.51) U4.1 ; U2.22 18.79,7.88 v1(19.02,7.65)
  Bottom Layer w0.254: v1(23.97,8.51) 23.03,8.51 22.17,7.65 v1(19.02,7.65)
O_TDI: length 3.3
  Top Layer w0.254: U4.4 27.22,7.21 27.58,7.57 27.58,9.35 28.08,9.85 R17.1
RXD: length 5.2
  Top Layer w0.254: P2.17 36.93,18.38 R30.2 R32.2
SRST: length 9.2
  Top Layer w0.254: R24.2 31.65,21.89 32.54,21 R23.2 34.01,21 v1(36.17,18.85) ; v1(36.45,17.91) 36.45,17.59 P2.15
  Bottom Layer w0.254: v1(36.45,17.91) 36.45,18.57 v1(36.17,18.85)
TCK: length 4.2
  Top Layer w0.254: R26.2 34.22,12.37 P2.9
TDI: length 4
  Top Layer w0.254: R27.2 33.86,9.83 P2.5
TDO: length 5.3
  Top Layer w0.254: R31.2 R28.2 36.73,16.04 P2.13
TMS: length 5.6
  Top Layer w0.254: v1(34.72,11.92) 35.55,11.1 P2.7 ; v1(34.72,12.79) 33.89,13.62 R25.2
  Bottom Layer w0.254: v1(34.72,11.92) v1(34.72,12.79)
TRST: length 4.6
  Top Layer w0.254: P2.3 36.57,7.26 R29.2
VIO: length 30.3
  Top Layer w0.201: U10.8 32.56,14.21 C15.2
  Top Layer w0.254: 31.08,19.92 31.08,17.97 31.32,17.73 31.32,17.34 ; 31.08,19.92 U9.6 C19.2 R32.1 ; 31.08,19.92 31.08,20.49 R23.1 ; v1(33.32,7.79) 33.32,8.08 C18.2 U8.6 31.88,8.56 31.32,9.12 31.32,11.15 ; R10.1 33.33,4.23 32.84,4.72 32.84,4.93 32.27,5.5 R12.1 32.27,6.27 C8.2 ; 31.32,11.15 31.32,11.86 v1(32.18,12.73) ; 31.32,11.15 U6.6 C16.2 ; 31.32,17.34 U7.6 32.59,17.34 C17.2 ; 31.32,17.34 31.32,15.65 31.6,15.37 32.04,15.37 v1(32.42,14.99) 32.84,14.57 C15.2 ; C8.2 v1(33.32,6.76) ; C8.2 R13.1
  Bottom Layer w0.254: v1(32.18,12.73) 32.84,13.39 32.84,14.57 v1(32.42,14.99) ; v1(33.32,6.76) v1(33.32,7.79)
VREF: length 10.4
  Top Layer w0.254: P2.1 35.1,4.52 35.1,2.39 34.49,1.78 33.02,1.78 32.47,2.33 R9.1 U3.1
$1N3245: length 2.8
  Top Layer w0.254: C3.2 11.05,16.3 11.68,15.67 11.68,14.99 11.92,14.75 U2.3
$1N3248: length 2.5
  Top Layer w0.254: U2.4 11.76,14.25 11.01,15 R8.2
$1N3444: length 2.1
  Top Layer w0.254: R1.2 11.05,9.58 11.72,10.25 U2.12
$1N3469: length 5.5
  Top Layer w0.254: U2.14 14.79,9.57 14.58,9.78 14.12,9.78 12.4,8.05 11.26,8.05 R2.2
$1N3474: length 6.2
  Top Layer w0.254: R3.2 11.29,8.41 12.25,8.41 13.97,10.13 14.73,10.13 15.29,9.58 U2.15
$1N3583: length 1.9
  Top Layer w0.254: U2.20 17.79,7.71 17.99,7.51 17.99,6.93
$1N3586: length 2.1
  Top Layer w0.254: R6.2 18.54,7.26 18.54,7.57 18.29,7.82 U2.21
$1N4934: length 1.5
  Top Layer w0.254: 23.17,10.62 23.17,10.75 R14.2
$1N14125: length 5.1
  Top Layer w0.254: X1.1 9.01,12.67 10.81,12.67 C1.2 11.34,12.75 U2.7
$1N14126: length 3.3
  Top Layer w0.254: U2.8 11.34,12.25 C2.1 10.26,12.02 X1.3
$1N15634: length 1.4
  Top Layer w0.201: U10.7 32.65,13.81 R25.1
$1N15637: length 1.6
  Top Layer w0.201: R26.1 32.18,13.41 U10.6
$1N15645: length 1.4
  Top Layer w0.201: U10.2 29.33,13.81 R15.2
$1N15648: length 1.6
  Top Layer w0.201: R16.2 29.78,13.41 U10.3
$1N15959: length 2.4
  Top Layer w0.254: Q2.3 32.1,22.34 32.55,21.89 R24.1
$1N16531: length 2.1
  Top Layer w0.254: R11.2 R10.2 U3.3
$1N16533: length 1.3
  Top Layer w0.254: D1.1 R12.2
$1N16535: length 2.1
  Top Layer w0.254: D1.2 28.28,5.77 29.03,5.02 U3.4
$1N17836: length 0.9
  Top Layer w0.254: U6.4 R27.1
$1N17840: length 0.9
  Top Layer w0.254: R17.2 U6.3
$1N18390: length 0.9
  Top Layer w0.254: U7.4 R28.1
$1N18396: length 0.9
  Top Layer w0.254: U7.3 30.06,16.05 R18.2
$1N18633: length 0.9
  Top Layer w0.254: U8.4 R29.1
$1N18638: length 0.9
  Top Layer w0.254: R19.2 U8.3
$1N18909: length 1
  Top Layer w0.254: R30.1 32.59,18.62 U9.4
$1N18911: length 0.9
  Top Layer w0.254: U9.3 30.05,18.63 R20.2
$1N20562: length 1.2
  Top Layer w0.254: R7.2 28.09,23.35 U1.3
$1N22925: length 3.9
  Top Layer w0.254: R22.2 30.9,22.37 31.34,22.37 31.6,22.63 Q2.1 31.6,22.89 30.42,24.06 Q1.3

## Copper pours and planes (outline as drawn; the poured copper is in the pictures)
GND on Bottom Layer: 0,26 42,26 42,0 0,0

Small or netless copper shapes (teardrops, artwork), in the pictures only: 339 on Top Layer, 31 on Bottom Layer

## Text on the board
Top Silkscreen Layer: RST | SWC | SWD | GND | 3.3V | JLCJLCJLCJLC | LED_G | LED_R | DM | NC | DP | 5V | SRST | TRST | VREF | TDO | RXD | TMS | TCK | TDI | 24/12/25 Peace | X-Link OB-RA4M2
